# EAGLE design HVIB_v5 (EAGLE 9.5.1)

## Sheet 1 of 2
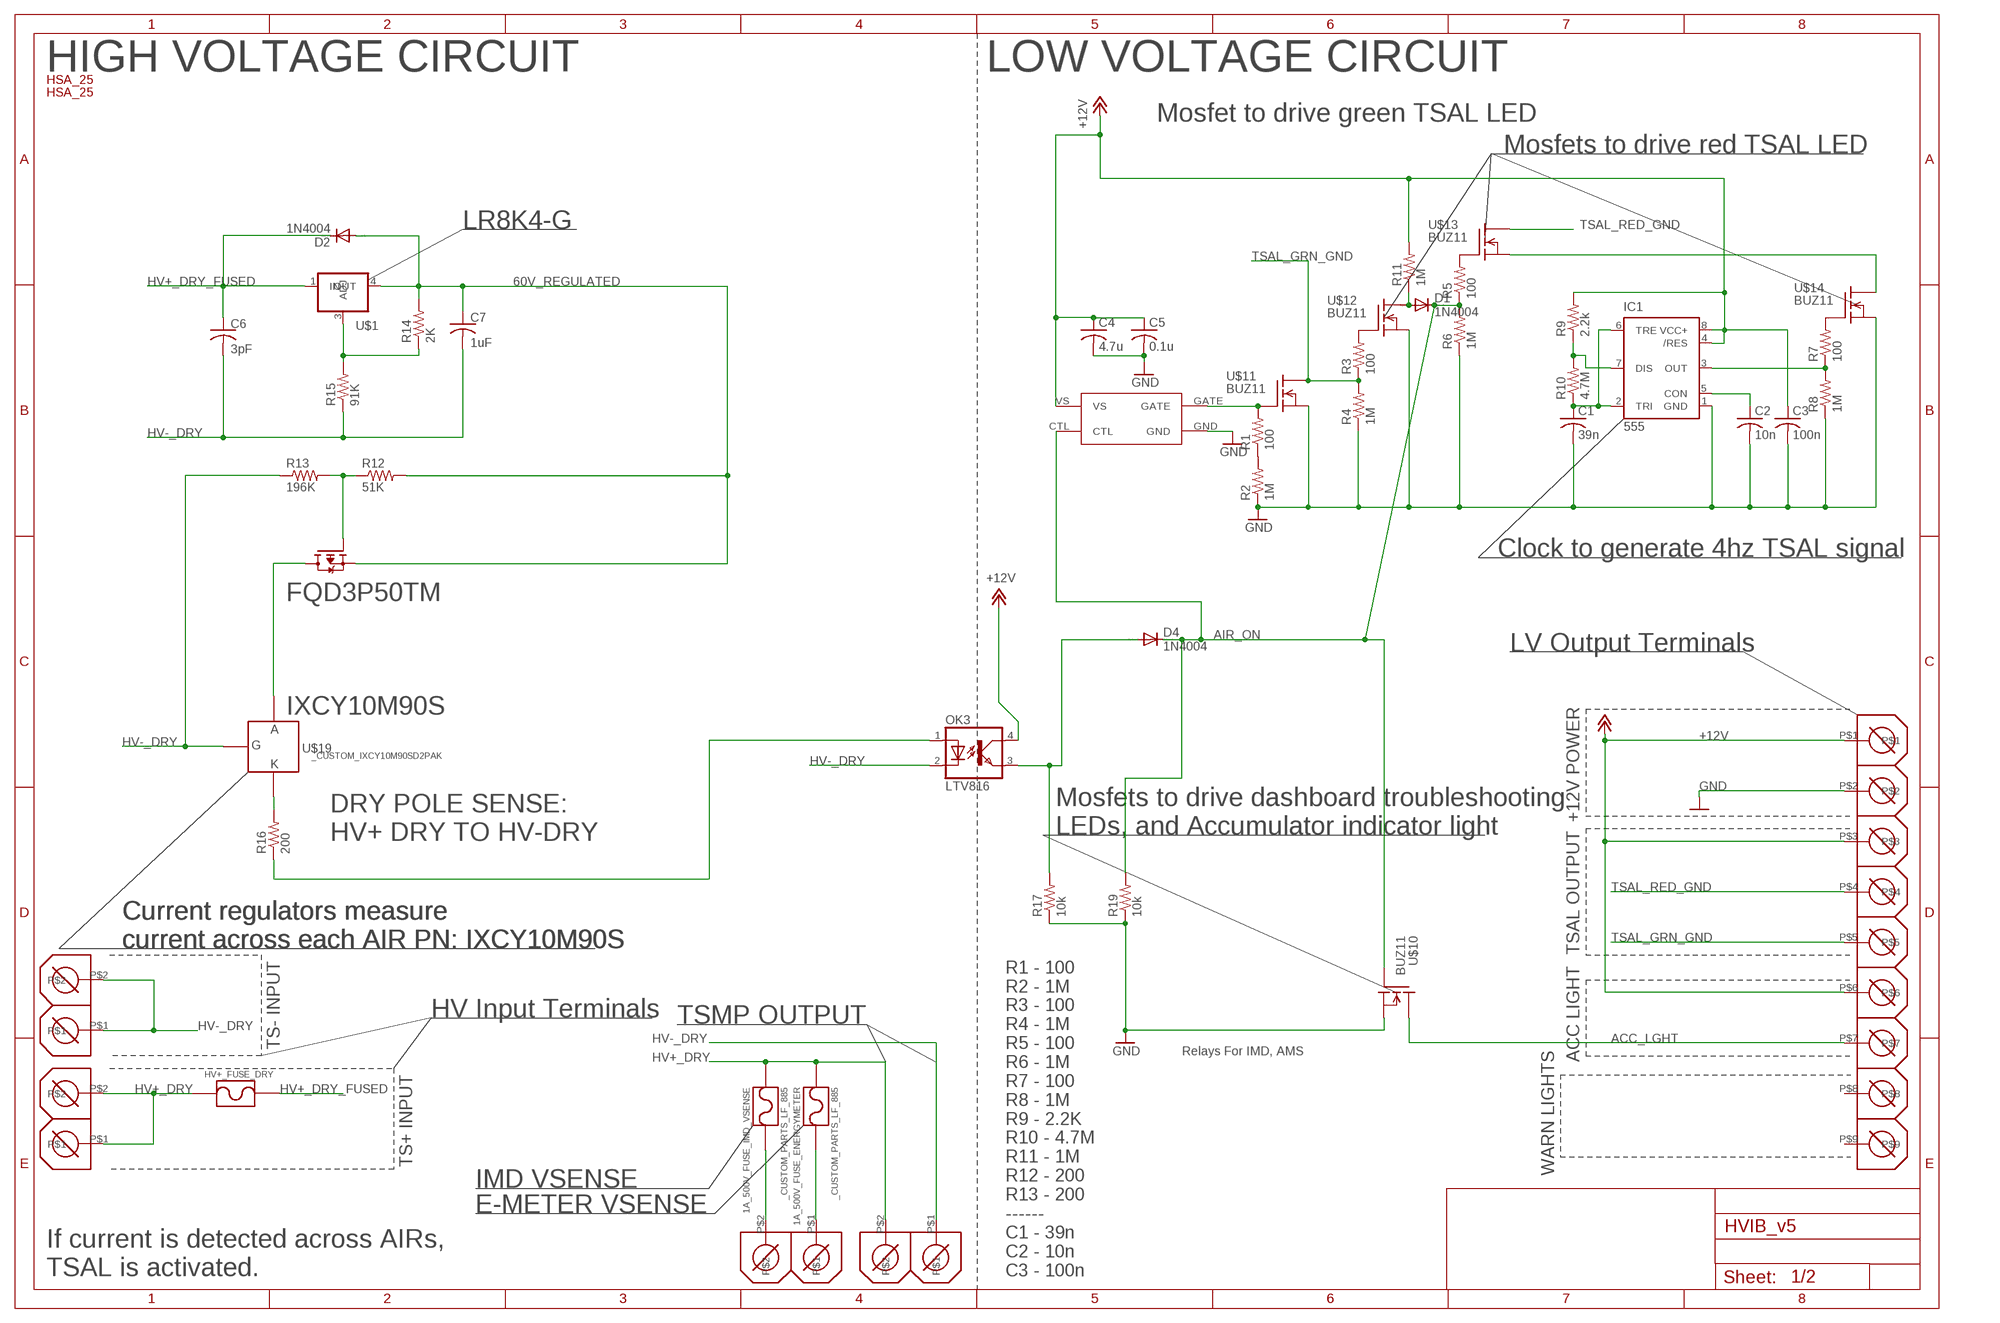
[diagram p0: schematic, sheet 1]

### Parts
1A_500V_FUSE_ENERGYMETER  _CUSTOM_PARTS_LF_885  [_CUSTOM_PARTS_LF_885]
1A_500V_FUSE_IMD_VSENSE  _CUSTOM_PARTS_LF_885  [_CUSTOM_PARTS_LF_885]
C1  39n  C-USC0805  [C0805]
C2  10n  C-USC0805  [C0805]
C3  100n  C-USC0805  [C0805]
C4  4.7u  C-USC0805  [C0805]
C5  0.1u  C-USC0805  [C0805]
C6  3pF  CAP1111  [1111_2828METRIC]
C7  1uF  C-USC2220K  [C2220K]
D1  1N4004  [DO41-10]
D2  1N4004  [DO41-10]
D4  1N4004  [DO41-10]
FQD3P50TM  FDD4141TO252  [TO252]
HV+_FUSE_DRY  _CUSTOM_PARTS_LF_885  [_CUSTOM_PARTS_LF_885]
IC1  555  555P  [DIP08]
OK3  LTV816  [DIL04]
R1  100  R-US_R0805  [R0805]
R2  1M  R-US_R0805  [R0805]
R3  100  R-US_R0805  [R0805]
R4  1M  R-US_R0805  [R0805]
R5  100  R-US_R0805  [R0805]
R6  1M  R-US_R0805  [R0805]
R7  100  R-US_R0805  [R0805]
R8  1M  R-US_R0805  [R0805]
R9  2.2k  R-US_R0805  [R0805]
R10  4.7M  R-US_R0805  [R0805]
R11  1M  R-US_R0805  [R0805]
R12  51K  R-US_R2010  [R2010]
R13  196K  R-US_R2010  [R2010]
R14  2K  R-US_R2010  [R2010]
R15  91K  R-US_R2010  [R2010]
R16  200  R-US_R2010  [R2010]
R17  10k  R-US_R0805  [R0805]
R19  10k  R-US_R0805  [R0805]
U$1  K4  [K4]
U$2  HSA25  [HSA_25_FOOT]
U$3  HSA25  [HSA_25_FOOT]
U$4  DCDC_PARTS_282838-2_TE  [DCDC_PARTS_282838-2_FOOT]
U$6  DCDC_PARTS_282838-2_TE  [DCDC_PARTS_282838-2_FOOT]
U$7  PHOENIX_1725724  [1725724_FOOT]
U$10  BUZ11  [TO220]
U$11  BUZ11  [TO220]
U$12  BUZ11  [TO220]
U$13  BUZ11  [TO220]
U$14  BUZ11  [TO220]
U$15  MIC4417  [PDM_2019_REVB_MIC4416YM4-TR]
U$16  DCDC_PARTS_282838-2_TE  [DCDC_PARTS_282838-2_FOOT]
U$17  DCDC_PARTS_282838-2_TE  [DCDC_PARTS_282838-2_FOOT]
U$19  _CUSTOM_IXCY10M90SD2PAK  [TO228P991X238-3]

### Nets
60V_REGULATED [HV]: C7.1 D2.A FQD3P50TM.2(S) R12.2 R14.2 U$1.4(OUT)
+12V: C3.1 C4.1 C5.1 IC1.4(/RES) IC1.8(VCC+) OK3.4(COL) R9.2 R11.2 U$7.P$1 U$7.P$3 U$7.P$6 U$15.VS
ACC_LGHT: U$7.P$7 U$10.2(D)
AIR_ON: D1.C D4.C R5.1 R6.2 R19.2 U$10.1(G) U$15.CTL
GND: C1.2 C2.2 C3.2 C4.2 C5.2 IC1.1(GND) R2.1 R4.1 R6.1 R8.1 R17.1 R19.1 U$7.P$2 U$10.3(S) U$11.3(S) U$12.3(S) U$14.3(S) U$15.GND
HV+_DRY [HV]: 1A_500V_FUSE_ENERGYMETER.P$1 1A_500V_FUSE_IMD_VSENSE.P$1 HV+_FUSE_DRY.P$2 U$6.P$1 U$6.P$2 U$16.P$2
HV+_DRY_FUSED [HV]: C6.P$1 D2.C HV+_FUSE_DRY.P$1 U$1.1(IN)
HV-_DRY [HV]: C6.P$2 C7.2 OK3.2(C) R13.1 R15.1 U$4.P$1 U$4.P$2 U$16.P$1 U$19.1(G)
N$1: R1.1 R2.2
N$2: R1.2 U$11.1(G) U$15.GATE
N$3: R3.2 U$12.1(G)
N$4: C2.1 IC1.5(CON)
N$5: IC1.7(DIS) R9.1 R10.2
N$6: R5.2 U$13.1(G)
N$7: R7.2 U$14.1(G)
N$8: IC1.3(OUT) R7.1 R8.2
N$9: C1.1 IC1.2(TRI) IC1.6(TRE) R10.1
N$10 [HV]: FQD3P50TM.3(D) U$19.3(A)
N$11 [HV]: FQD3P50TM.1(G) R12.1 R13.2
N$13: U$13.3(S) U$14.2(D)
N$14: D4.A OK3.3(EMIT) R17.2
N$15: D1.A R11.1 U$12.2(D)
N$16: R16.2 U$19.2(K)
N$17 [HV]: R14.1 R15.2 U$1.3(ADJ)
N$18 [HV]: 1A_500V_FUSE_IMD_VSENSE.P$2 U$17.P$2
N$19 [HV]: 1A_500V_FUSE_ENERGYMETER.P$2 U$17.P$1
N$22: OK3.1(A) R16.1
TSAL_GRN_GND: R3.1 R4.2 U$7.P$5 U$11.2(D)
TSAL_RED_GND: U$7.P$4 U$13.2(D)
Unconnected: U$7.P$8 U$7.P$9

### Notes on the sheet
- HIGH VOLTAGE CIRCUIT | LOW VOLTAGE CIRCUIT
- Mosfet to drive green TSAL LED
- Mosfets to drive red TSAL LED
- LR8K4-G
- Clock to generate 4hz TSAL signal
- LV Output Terminals
- IXCY10M90S
- +12V POWER
- Mosfets to drive dashboard troubleshooting
  LEDs, and Accumulator indicator light
- DRY POLE SENSE:
  HV+ DRY TO HV-DRY
- Current regulators measure 
  current across each AIR PN: IXCY10M90S
- Current regulators measure 
  current across each AIR PN: IXCY10M90S
- Current regulators measure 
  current across each AIR PN: IXCY10M90S
- TSAL OUTPUT
- TS- INPUT
- HV Input Terminals | TSMP OUTPUT
- Relays For IMD, AMS
- ACC LIGHT
- TS+ INPUT
- WARN LIGHTS
- IMD VSENSE
- E-METER VSENSE
- If current is detected across AIRs, 
  TSAL is activated.
- R1 - 100
  R2 - 1M
  R3 - 100
  R4 - 1M
  R5 - 100
  R6 - 1M
  R7 - 100
  R8 - 1M
  R9 - 2.2K
  R10 - 4.7M
  R11 - 1M
  R12 - 200
  R13 - 200
  ------
  C1 - 39n
  C2 - 10n
  C3 - 100n

## Sheet 2 of 2
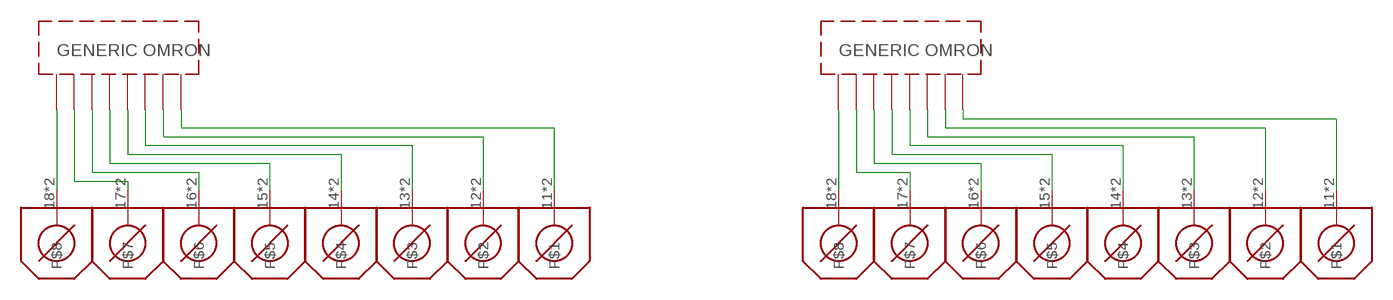
[diagram p1: schematic, sheet 2]

### Parts
U$5  G2R_RLY  [OMRON_RLY_FOOT]
U$8  G2R_RLY  [OMRON_RLY_FOOT]
U$9  PHOENIX_1771017  [8PIN_HEAD]
U$18  PHOENIX_1771017  [8PIN_HEAD]

### Nets
N$12: U$5.1 U$9.18 U$9.28
N$20: U$5.2 U$9.17 U$9.27
N$21: U$5.3 U$9.16 U$9.26
N$23: U$5.4 U$9.15 U$9.25
N$24: U$5.5 U$9.14 U$9.24
N$25: U$5.6 U$9.13 U$9.23
N$26: U$5.7 U$9.12 U$9.22
N$27: U$5.8 U$9.11 U$9.21
N$28: U$8.1 U$18.18 U$18.28
N$29: U$8.2 U$18.17 U$18.27
N$30: U$8.3 U$18.16 U$18.26
N$31: U$8.4 U$18.15 U$18.25
N$32: U$8.5 U$18.14 U$18.24
N$33: U$8.6 U$18.13 U$18.23
N$34: U$8.7 U$18.12 U$18.22
N$35: U$8.8 U$18.11 U$18.21

## Library data of the parts
1A_500V_FUSE_ENERGYMETER 1A_500V_FUSE_IMD_VSENSE HV+_FUSE_DRY = _CUSTOM:_CUSTOM_PARTS_LF_885
C1-C5 = resistor:C-US: CAPACITOR, American symbol
C6 = 111_Custom:CAP1111
C7 = rcl:C-US: CAPACITOR, American symbol; SPICEPREFIX: C
D1 D2 D4 = diode:1N4004: DIODE general purpose rectifier, 1 A
FQD3P50TM = transistor-fet:FDD4141: P-Channel PowerTrench® MOSFET Source: FDD4141.pdf
IC1 = SparkFun-IC-Special-Function:555: General purpose bipolar Timer Datasheet <http://www.sparkfun.com/datasheets/Components/General/ne555.pdf> SparkFun Products SparkFun SparkPunk Sequencer Kit <https://www.sparkfun.com/products/12707> (KIT-12707) Storefront Component: 555 Timer <https://www.sparkfun.com/products/9273> (COM-09273) Two parts valid for production: VFP: IC-11930 (M7555 PTH) VFP: IC-09173 (555 PTH) - Preferred; PROD_ID: IC-09173; PROD_ID_ALT: IC-09173
OK3 = optocoupler:LTV816: OPTO COUPLER Source: LITEON, LTV816.pdf; OC_FARNELL: unknown; OC_NEWARK: unknown
R1-R11 R17 R19 = resistor:R-US_: RESISTOR, American symbol
R12-R16 = rcl:R-US_: RESISTOR, American symbol; SPICEPREFIX: R
U$1 = v-reg_supertex:K4: LR8 or LR12 [TO-252 = D-PAK]
U$2 U$3 = 111_Custom:HSA25
U$4 U$6 U$16 U$17 = _CUSTOM:DCDC_PARTS_282838-2_TE
U$5 U$8 = 111_Custom:G2R_RLY
U$7 = 111_Custom:PHOENIX_1725724
U$9 U$18 = 111_Custom:PHOENIX_1771017
U$10-U$14 = transistor-fet:BUZ11: N-Channel Enhancement MOSFET 50V; 30A; 0,040Ohm
U$15 = HVIB_v2:MIC4417; MPN: MIC4417
U$19 = HVIB_v2:_CUSTOM_IXCY10M90S

## Net classes
0 LV: width 1 mm, drill 0.15 mm, clearance 0.2 mm
1 HV: width 1 mm, drill 0.15 mm, clearance 2 mm

## Board
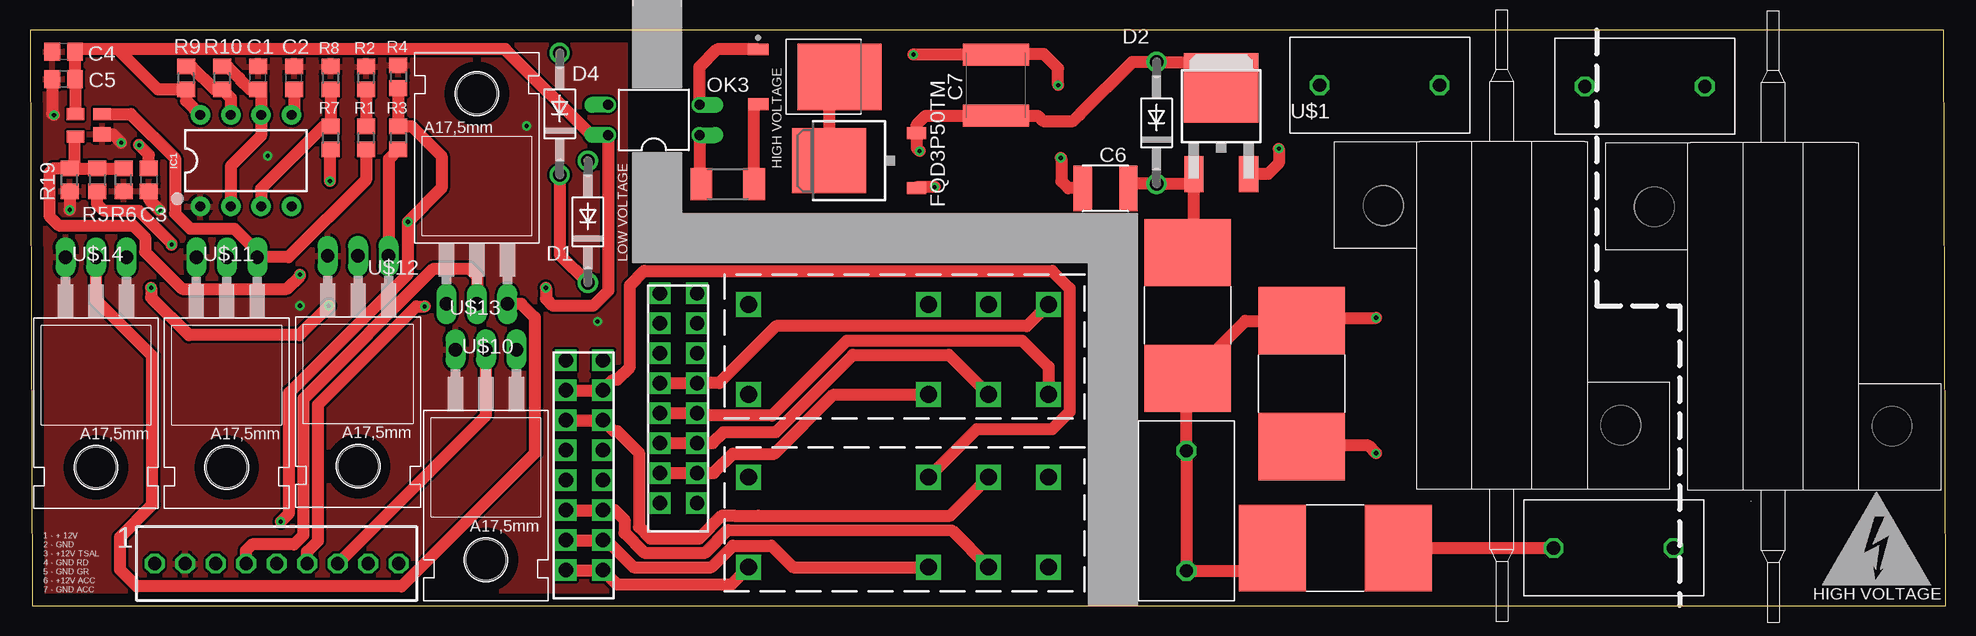
[diagram p2: board, top side]
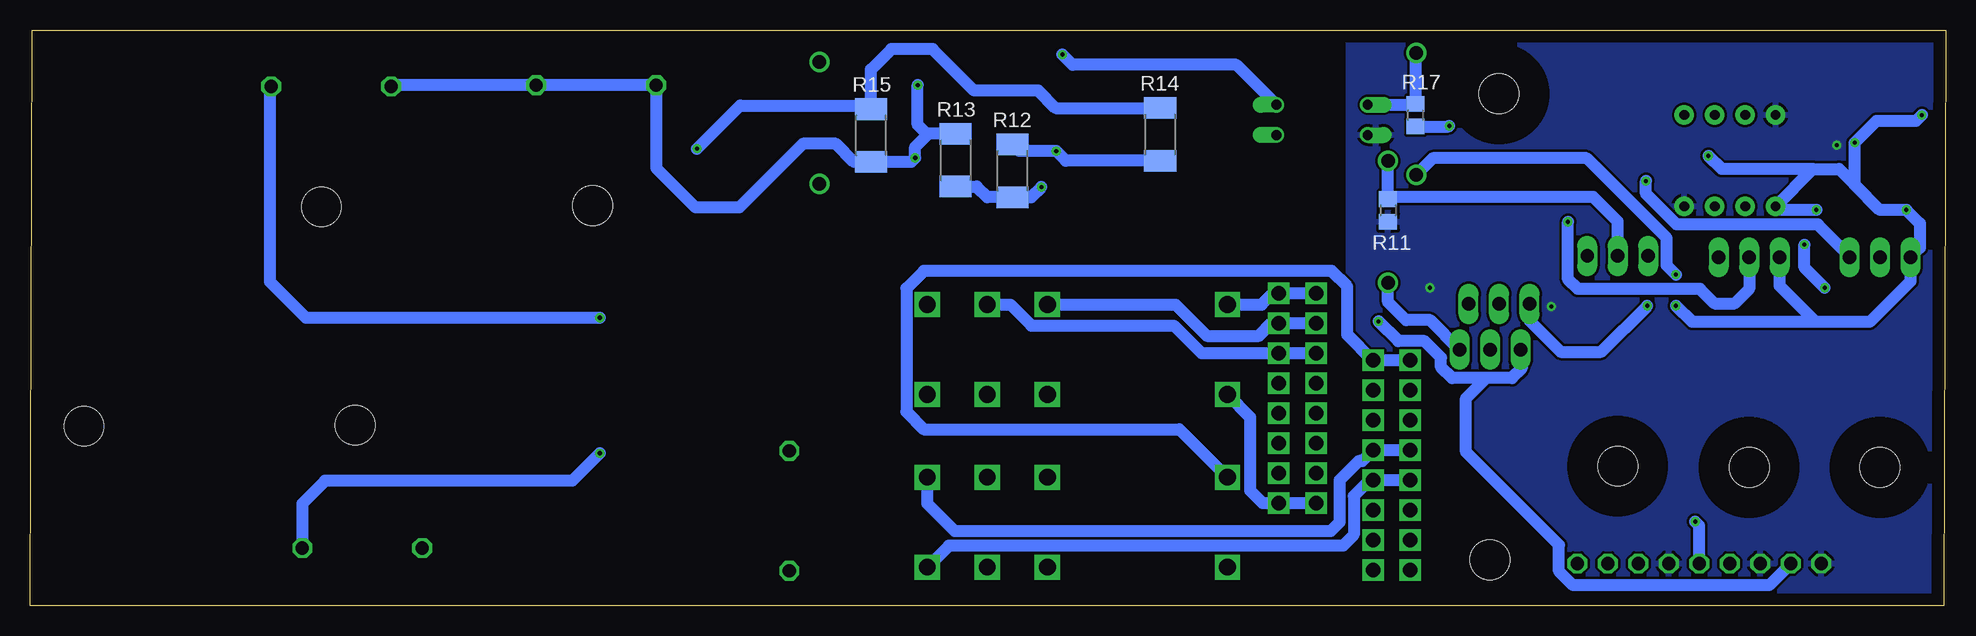
[diagram p3: board, bottom side, seen from below]

Size 159.7 x 48 mm. Coordinates in mm from the lower left corner, seen from the top.
Outline: 0.2,0 159.7,0 159.5,48 0,48 0.2,0
Copper layers (1*16): Top 0.035mm / dielectric 1.5mm / Bottom 0.035mm
Design rules "default": minimum track width 6mil, minimum drill 0.35mm, track to track 6mil, track to pad 6mil, pad to pad 6mil, via to via 6mil, smd to smd 6mil, copper to edge 40mil, drill to drill 6mil, minimum pad ring 10mil, minimum via ring 8mil, stop-mask expansion 4mil, vias tented up to drill 0mil, thermal gap 10mil
tRestrict: area 50.2,29 to 54.2,51
bRestrict: area 50.2,29 to 54.2,51

### Footprints (pad centres in the part's own frame; a part is rotated, then mirrored left to right if it is on the bottom)
_CUSTOM_PARTS_LF_885 = smd 5.6 x 7.23: P$1 5.25,0; P$2 -5.25,0
C0805 = smd 1.3 x 1.5: 1 -0.95,0; 2 0.95,0
1111_2828METRIC = smd 1.524 x 3.81: P$1 -1.905,0; P$2 1.905,0
C2220K = smd 1.85 x 5.5: 1 -2.55,0; 2 2.55,0
DO41-10 = drill 1.118: A 5.08,0; C -5.08,0
TO252 = smd 1 x 1.6: 1 -2.28,-4.8; 2 2.28,-4.8 | smd 5.4 x 6.2: 3 0,2.5
DIP08 = drill 0.813 pad 1.626: 1 -3.81,-3.81; 2 -1.27,-3.81; 3 1.27,-3.81; 4 3.81,-3.81; 5 3.81,3.81; 6 1.27,3.81; 7 -1.27,3.81; 8 -3.81,3.81
DIL04 = drill 0.813 offset: 1 -1.27,-3.81; 2 1.27,-3.81; 3 1.27,3.81; 4 -1.27,3.81
R0805 = smd 1.3 x 1.5: 1 -0.95,0; 2 0.95,0
R2010 = smd 1.8 x 2.7: 1 -2.2,0; 2 2.2,0
K4 = smd 1.6 x 3: 1 -2.28,-4.8; 3 2.28,-4.8 | smd 6.2 x 5.8: 4 0,2.38
HSA_25_FOOT = hole 3.3: 34.65,23.9; 16.35,4.1
DCDC_PARTS_282838-2_FOOT = drill 1.1 octagon: P$1 0,0; P$2 10,0
OMRON_RLY_FOOT = drill 1.4 square: 1 0,7.5; 2 15,7.5; 3 20,7.5; 4 25,7.5; 5 25,0; 6 20,0; 7 15,0; 8 0,0
1725724_FOOT = drill 1.1 octagon: P$1 0,0; P$2 2.54,0; P$3 5.08,0; P$4 7.62,0; P$5 10.16,0; P$6 12.7,0; P$7 15.24,0; P$8 17.78,0; P$9 20.32,0
8PIN_HEAD = drill 1.2 square: 11 0,0; 12 2.5,0; 13 5,0; 14 7.5,0; 15 10,0; 16 12.5,0; 17 15,0; 18 17.5,0; 21 0,3.1; 22 2.5,3.1; 23 5,3.1; 24 7.5,3.1; 25 10,3.1; 26 12.5,3.1; 27 15,3.1; 28 17.5,3.1
TO220 = drill 1.118 long: 1 -2.54,-6.35; 2 0,-6.35; 3 2.54,-6.35 | hole 3.302: 0,11.176
PDM_2019_REVB_MIC4416YM4-TR = smd 1 x 1.44: CTL 0,0; GATE 1.9,-2.2; VS 1.9,0 | smd 1.2 x 1.44: GND 0.2,-2.2
TO228P991X238-3 = smd 1.718 x 0.974: 1 -4.704,2.28; 2 -4.704,-2.28 | smd 7.001 x 5.544: 3 2.063,0

### Placement (x,y rotation side)
1A_500V_FUSE_ENERGYMETER  108.8,4.8 180 top
1A_500V_FUSE_IMD_VSENSE  106,18.5 90 top
C1  19,44 90 top
C2  22,44 90 top
C3  9.9,35.5 270 top
C4  2.8,46.2 180 top
C5  2.8,43.9 180 top
C6  89.65,34.8 180 top
C7  80.5,43.4 90 top
D1  46.5,32 90 top
D2  93.9,40.25 90 top
D4  44.15,41 90 top
FQD3P50TM  69.1,37.1 90 top
HV+_FUSE_DRY  96.5,24.2 90 top
IC1  18,37.1 0 top
OK3  52,40.5 90 top
R1  28,39 270 top
R2  28,44 270 top
R3  30.7,39 270 top
R4  30.7,44.1 270 top
R5  5.6,35.5 270 top
R6  7.8,35.5 90 top
R7  25.05,39 270 top
R8  25.05,44 270 top
R9  13,44 270 top
R10  16,44 270 top
R11  46.5,32.95 270 bottom
R12  77.8,36.25 90 bottom
R13  82.55,37.15 270 bottom
R14  65.5,39.3 270 bottom
R15  89.6,39.2 90 bottom
R16  58.15,35.15 0 top
R17  44.2,40.9 90 bottom
R19  3.3,35.5 90 top
U$1  99.3,40.8 0 top
U$2  159.3,-1.4 90 top
U$3  136.7,-1.3 90 top
U$4  117.5,43.4 180 top
U$5  59.9,17.6 0 top
U$6  96.4,2.9 90 top
U$7  10.4,3.5 0 top
U$8  59.9,3.2 0 top
U$9  55.6,8.55 90 top
U$10  38,15 180 top
U$11  16.4,22.7 180 top
U$12  27.35,22.8 180 top
U$13  37.25,31.5 0 top
U$14  5.5,22.7 180 top
U$15  3.8,39.1 90 top
U$16  129.6,43.3 0 top
U$17  127,4.8 0 top
U$18  47.75,2.95 90 top
U$19  65.4,44.1 0 top

### Tracks (layer width: path | path; a pad name or v marks a point on that pad's centre or on a via)
60V_REGULATED  (via drill 0.35)
  Top 1: U$1.4 97.15,45.33 D2.A 91.88,45.33 87.49,40.94 87.48,40.94 86.94,40.4 84.46,40.4 84.01,40.85 C7.1 74.65,40.85 73.9,40.1 FQD3P50TM.2 73.9,38.16 v74.16,37.9
  Bottom 1: R14.2 73.36,37.1 v74.16,37.9 77.25,37.9 R12.2
+12V  (via drill 0.35)
  Top 1: IC1.8 13,42.1 R9.2 10.65,43.05 7.3,46.4 | U$15.VS 3.8,43.85 C5.1 C4.1 3.95,46.4 7.3,46.4 | C3.1 9.9,37.6 v9.1,38.4 | 7.3,46.4 39.62,46.4 46.81,39.21 48.17,39.21 OK3.4 48.19,26.23 46.94,24.98 43.61,24.98 43,25.59 v43,26.5 | U$7.P$6 23.1,4.48 24,5.38 24,16.75 32.2,24.95 v32.9,24.95
  pour Bottom: -1.9,53.1 49.8,53.1 49.8,-2 -1.9,-2
ACC_LGHT
  Top 1: U$7.P$7 38,15.86 U$10.2
AIR_ON  (via drill 0.35)
  Top 1: R19.2 R5.1 R6.2 | R19.2 3.7,36.85 3.7,39.1 U$15.CTL | D4.C 44.15,29.27 D1.C | R19.2 1.97,36.45 1.62,36.1 1.62,32.5 2.42,31.7 8.6,31.7 9.6,30.7 9.6,29.5 12.7,26.4 21.4,26.4 22.5,27.5 v22.5,27.6
  Bottom 1: U$10.1 42.99,23.8 45,23.8 46.5,25.3 D1.C | v22.5,27.6 23.27,28.37 23.27,30.62 29.95,37.3 42.77,37.3 D4.C
GND  (via drill 0.35)
  Top 1: U$15.GND 6.9,39.3 v7.6,38.6 | C5.2 1.85,41.05 v2,40.9 | R19.1 v3.3,33 | C3.2 9.9,33.9 v10.8,33
  Bottom 1: 7.6,35.1 v7.6,38.6 5.8,40.4 2.5,40.4 v2,40.9 | R17.1 41.45,39.95 v41.4,40 | 7.6,35.1 5.5,33 v3.3,33 2.16,31.86 2.16,29.85 U$14.3 2.96,27.04 6.35,23.65 10.85,23.65 | 11.08,36.4 IC1.1 13.9,33 v10.8,33 | 7.6,35.1 8.9,36.4 11.08,36.4 | v47.3,23.7 45.65,22.05 43.46,22.05 42.08,20.67 42.08,19.88 41.18,18.97 38.3,18.97 | U$10.3 35.36,21.25 35.36,19.77 36.16,18.97 38.3,18.97 | U$7.P$2 14.74,1.7 31.08,1.7 32.24,2.87 32.24,5.04 40,12.8 40,17.27 38.3,18.97 | 10.85,23.65 13.86,26.66 U$11.3 | 10.85,23.65 21.15,23.65 v22.5,25 | 11.08,36.4 18.7,36.4 v19.8,37.5
  pour Top: -1,51.9 49.55,51.9 49.55,-2 -1,-2
HV+_DRY  (via drill 0.35)
  Top 1: 1A_500V_FUSE_ENERGYMETER.P$1 101.65,2.9 U$6.P$1 U$6.P$2 96.4,18.85 HV+_FUSE_DRY.P$2 101.3,23.75 1A_500V_FUSE_IMD_VSENSE.P$1 106.25,24 v112.2,24
  Bottom 1: v112.2,24 136.7,24 139.7,27 139.7,43.2 U$16.P$2
HV+_DRY_FUSED
  Top 1: 97.02,35.4 U$1.1 | 97.02,35.4 96.79,35.17 D2.C 91.92,35.17 C6.P$1 | HV+_FUSE_DRY.P$1 97.02,29.97 97.02,35.4
HV-_DRY  (via drill 0.35)
  Top 1: U$19.1 57.28,46.38 55.8,44.9 55.81,44.89 OK3.2 | C6.P$2 86.55,34.8 85.96,35.38 85.96,37.29 v85.91,37.34 | v85.7,43.4 85.7,44.8 84.5,46 80.55,46 C7.2 v73.64,45.95
  Bottom 1: U$16.P$1 129.5,43.4 U$4.P$1 U$4.P$2 107.5,36.5 104.2,33.2 100.59,33.2 95.28,38.51 92.52,38.51 91.01,37 R15.1 86.25,37 v85.91,37.34 85.91,38.24 84.8,39.35 R13.1 84.95,39.35 85.7,40.1 v85.7,43.4 | OK3.2 59.14,45.1 72.79,45.1 v73.64,45.95
N$1
  Top 1: R2.2 R1.1
N$2
  Top 1: R1.2 28,35.5 21.55,29.05 U$11.1 18.94,29.52 17.04,31.43 13.37,31.43 12.1,32.7 12.1,37.3 8.4,41 U$15.GATE
N$3
  Top 1: R3.2 29.9,37.25 U$12.1
N$4
  Top 1: C2.1 22,41.1 IC1.5
N$5
  Top 1: R9.1 13.49,44.95 15.39,43.05 R10.2 16.73,42.32 IC1.7
N$6  (via drill 0.35)
  Top 1: v24.9,25 22.45,22.55 13.25,22.55 10.1,25.7 v10.1,26.5 | v11.8,30.1 11.8,30.2 9.1,32.9 6.2,32.9 5.6,33.5 R5.2
  Bottom 1: U$13.1 34.71,23.76 32.1,21.15 28.75,21.15 v24.9,25 | v10.1,26.5 11.8,28.2 v11.8,30.1
N$7  (via drill 0.35)
  Top 1: v25,35.4 25,38 R7.2
  Bottom 1: U$14.1 8.04,29.15 10.67,31.78 21.9,31.78 22.44,31.78 25,34.34 v25,35.4
N$8
  Top 1: R8.2 R7.1 24.45,39.95 19.27,34.77 IC1.3
N$9
  Top 1: R10.1 16.49,44.95 17.45,43.99 17.45,43.95 18.35,43.05 C1.1 19.27,42.78 IC1.6 19.27,39.17 16.73,36.63 IC1.2
N$10
  Top 1: U$19.3 66.6,43.24 FQD3P50TM.3
N$11  (via drill 0.35)
  Top 1: v75.4,34.9 73.98,34.9 FQD3P50TM.1
  Bottom 1: v75.4,34.9 76.25,34.05 R12.1 79.9,34.05 80.8,34.95 R13.2
N$12
  Bottom 1: U$5.1 57.05,25.1 56.1,26.05 U$9.18 U$9.28
N$13
  Top 1: U$14.2 5.5,25.5 10.2,20.8 10.2,8.4 7.5,5.7 7.5,3 8.9,1.6 30.98,1.6 42.08,12.7 42.08,24.02 40.95,25.15 U$13.3
N$14
  Bottom 1: D4.A 44.2,46.03 R17.2 44.28,41.77 OK3.3
N$15
  Bottom 1: D1.A R11.1 46.3,34.1 29.43,34.1 27.35,32.02 U$12.2
N$16
  Top 1: R16.2 60.35,41.47 U$19.2
N$17  (via drill 0.35)
  Top 1: v104.1,38.1 104.1,36.9 103.2,36 U$1.3
  Bottom 1: v104.1,38.1 100.5,41.7 89.9,41.7 R15.2 89.6,44.7 87.9,46.4 84.46,46.4 81.01,42.95 75.65,42.95 74.2,41.5 R14.1
N$18  (via drill 0.35)
  Top 1: 1A_500V_FUSE_IMD_VSENSE.P$2 106.1,13.35 111.55,13.35 v112.2,12.7
  Bottom 1: v112.2,12.7 114.5,10.4 135.1,10.4 137,8.5 U$17.P$2
N$19
  Top 1: 1A_500V_FUSE_ENERGYMETER.P$2 U$17.P$1
N$20
  Bottom 1: U$5.2 64.2,25.1 61.6,22.5 57.25,22.5 56.2,23.55 U$9.17 U$9.27
N$21
  Bottom 1: U$5.3 77.99,25.1 76.24,23.35 64.35,23.35 62.05,21.05 U$9.16 U$9.26
N$22
  Top 1: OK3.1 55.81,35.29 R16.1
N$23
  Top 1: U$5.4 83.1,23.3 62.2,23.3 57.45,18.55 U$9.15 U$9.25
N$24
  Top 1: U$9.24 U$9.14 55.8,15.85 61.85,15.85 68.1,22.1 82.7,22.1 84.9,19.9 U$5.5
N$25
  Top 1: U$9.23 U$9.13 56.9,13.55 57.8,14.45 62.15,14.45 68.6,20.9 76.6,20.9 U$5.6
N$26
  Top 1: U$9.22 U$9.12 56.99,11.05 58.59,12.65 62.04,12.65 66.99,17.6 U$5.7
N$27
  Bottom 1: U$5.8 58,15.7 58,9.6 56.95,8.55 U$9.11 U$9.21
N$28
  Bottom 1: U$18.28 U$18.18 49.9,22.6 49.9,26.6 51.2,27.9 85.19,27.9 86.65,26.44 86.65,16.15 85.2,14.7 63.9,14.7 U$8.1
N$29
  Top 1: U$18.27 U$18.17 48.65,18.85 48.94,18.85 50,19.91 50,26.7 51.2,27.9 85.19,27.9 86.65,26.44 86.65,16.15 85.2,14.7 78.9,14.7 U$8.2
N$30
  Top 1: U$18.26 U$18.16 48.65,14.55 48.94,14.55 50.75,12.74 50.75,6.55 51.7,5.6 55.8,5.6 57.7,7.5 58.2,7.5 58.7,7.5 60.7,7.49 76.69,7.49 U$8.3
N$31
  Bottom 1: U$18.25 U$18.15 48.65,12.05 48.94,12.05 50.55,10.44 50.55,6.95 51.3,6.2 82.6,6.2 84.9,8.5 U$8.4
N$32
  Bottom 1: U$18.24 U$18.14 48.04,10.45 49.35,9.14 49.35,5.9 50.25,5 83.1,5 U$8.5
N$33
  Top 1: U$18.23 U$18.13 48.75,7.95 49.55,7.15 49.55,6.05 51.2,4.4 56.3,4.4 58.2,6.3 76.85,6.25 U$8.6
N$34
  Top 1: U$18.22 U$18.12 48.05,5.45 50.3,3.2 56.8,3.2 58.6,5 61.8,5 63.6,3.2 U$8.7
N$35
  Top 1: U$18.21 U$18.11 48.95,1.75 58.45,1.75 U$8.8
TSAL_GRN_GND  (via drill 0.35)
  Top 1: R4.2 R3.1 31.85,39.95 34.3,37.5 34.3,34.8 v31.5,32 31.5,27.65 21.6,17.75 21.6,7.7 v20.9,7
  Bottom 1: U$11.2 16.4,26.4 17.6,25.2 19.3,25.2 20.5,26.4 30.7,26.4 31.5,27.2 v31.5,32 | U$7.P$5 20.56,6.66 v20.9,7
TSAL_RED_GND
  Top 1: U$7.P$4 18.02,4.6 18.52,5.1 22.02,5.1 22.8,5.88 22.8,17.25 33.65,28.1 36.6,28.1 37.25,27.45 U$13.2

### Text on the board
tPlace: LOW VOLTAGE | HIGH VOLTAGE | 1 | 1 - + 12V / 2 - GND / 3 - +12V TSAL / 4 - GND RD / 5 - GND GR / 6 - +12V ACC / 7 - GND ACC | HIGH VOLTAGE